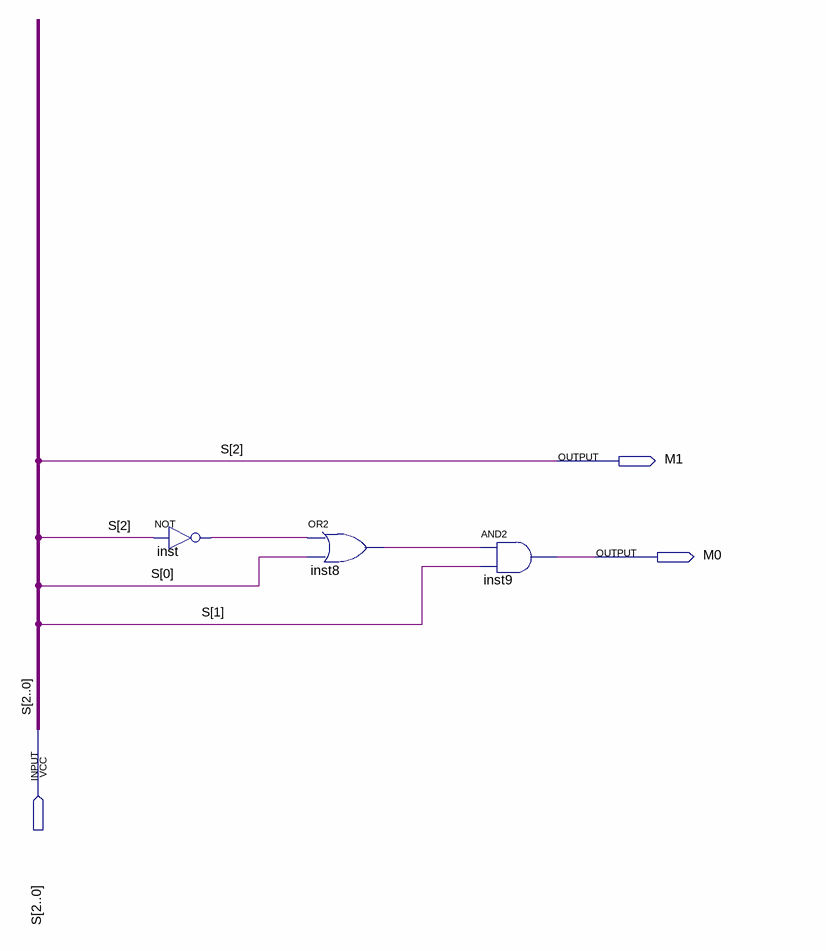
[diagram p0: schematic sheet]
// Quartus schematic DecodificadorCima.bdf as structural Verilog: 3 symbols, 3 pins
module DecodificadorCima (
  input  [2:0] S,
  output M1,
  output M0
);

  wire inst8_out, inst_out;

  not inst (inst_out, S[2]);
  or inst8 (inst8_out, inst_out, S[0]);
  and inst9 (M0, inst8_out, S[1]);

  assign M1 = S[2];
endmodule
